# EAGLE design PCB 111000_CC (EAGLE 9.0.1)
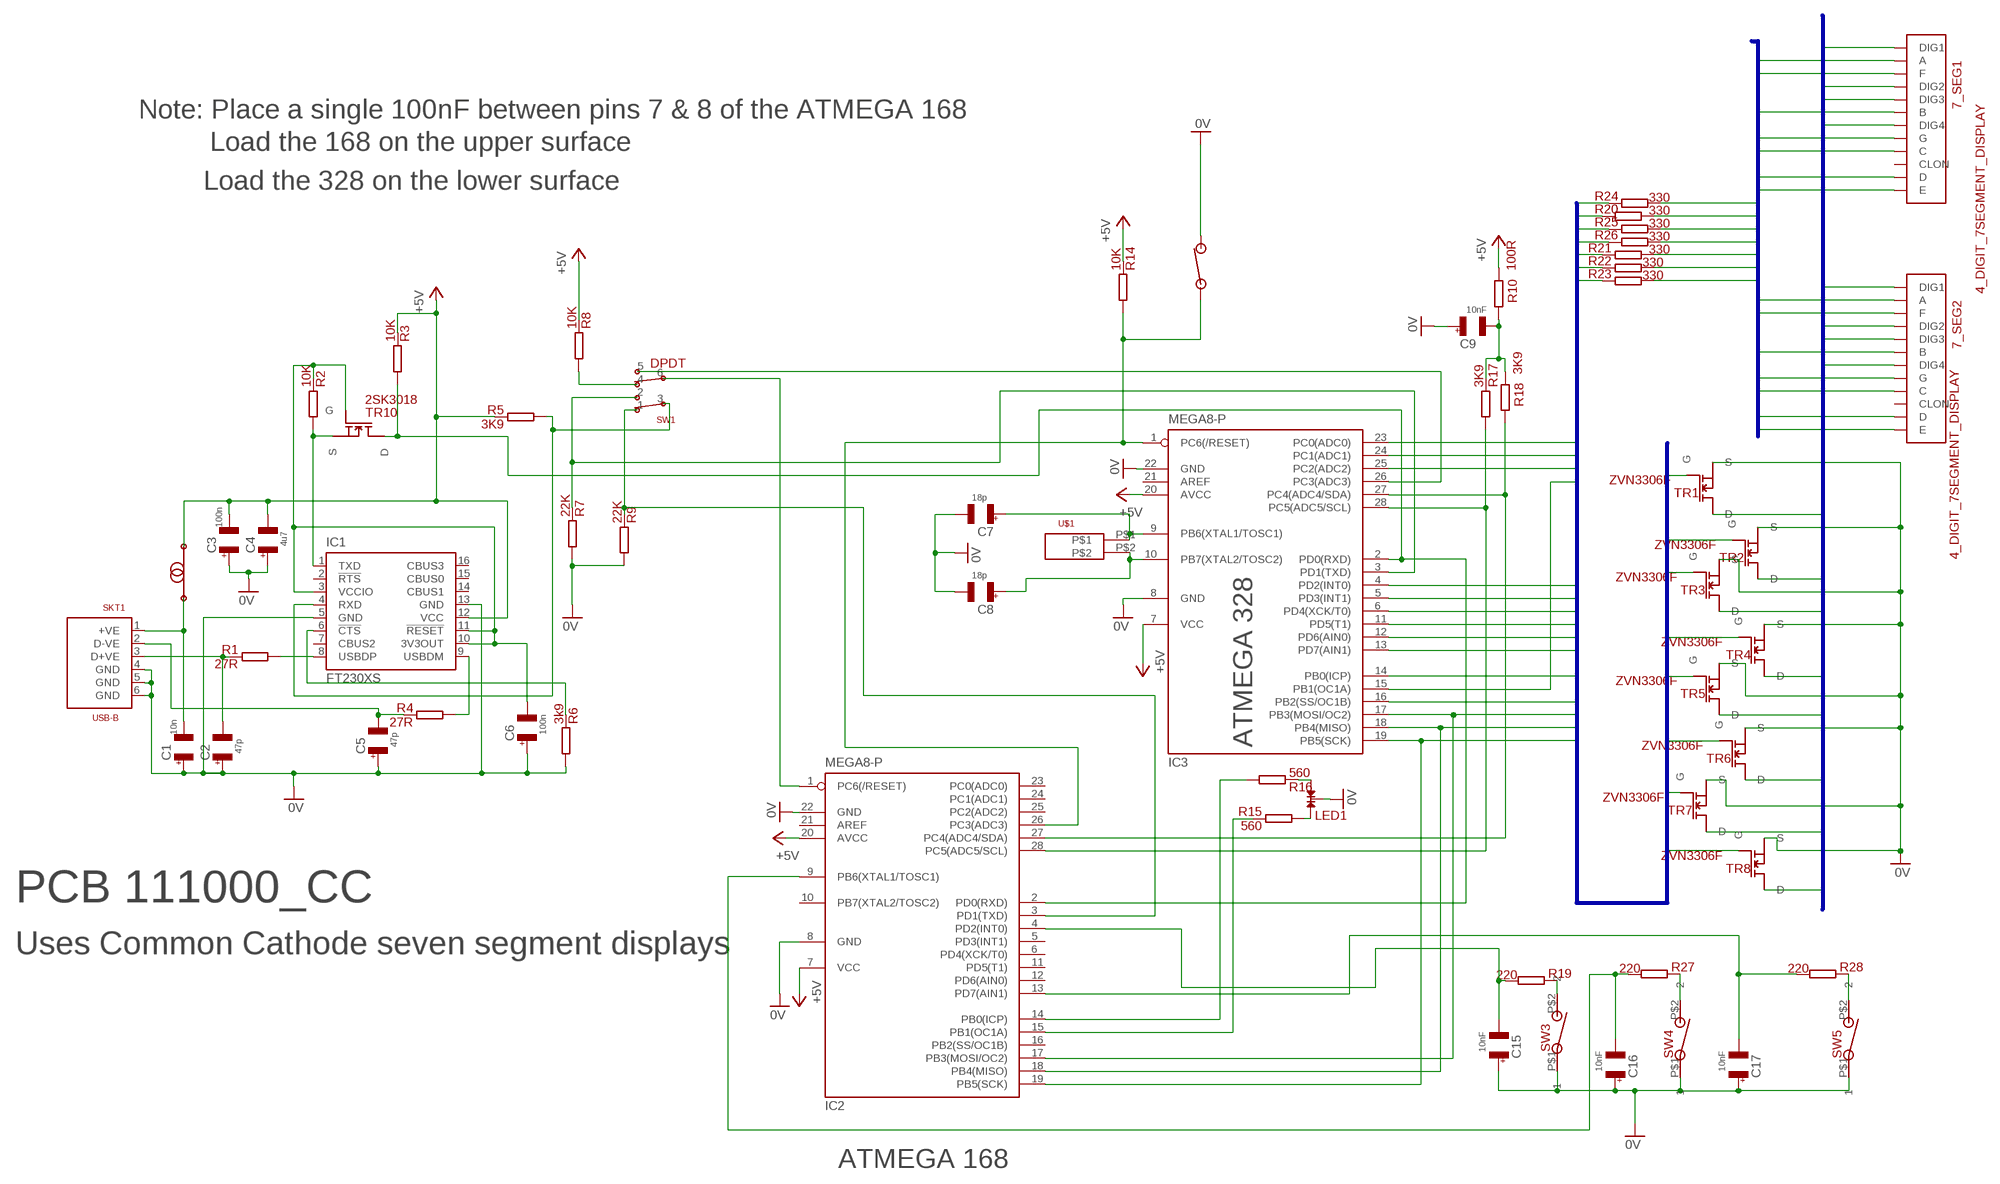
[diagram p0: schematic, sheet 1]

## Parts
7_SEG1  4_DIGIT_7SEGMENT_DISPLAY  [4_DIGIT_7SEGMENT_DISPLAY]
7_SEG2  4_DIGIT_7SEGMENT_DISPLAY  [4_DIGIT_7SEGMENT_DISPLAY]
C1  10n  1206C  [1206]
C2  47p  1206C  [1206]
C3  100n  1206C  [1206]
C4  4u7  1206C  [1206]
C5  47p  1206C  [1206]
C6  100n  1206C  [1206]
C7  18p  0805C  [0805]
C8  18p  0805C  [0805]
C9  10nF  1206C  [1206]
C15  10nF  1206C  [1206]
C16  10nF  1206C  [1206]
C17  10nF  1206C  [1206]
IC1  FT230XS  [SSOP16]
IC2  MEGA8-P  [DIL28-3]
IC3  MEGA8-P  [DIL28-3]
L1  CHOKE  [1206]
LED1  LED  [CA_DUAL_LED]
R1  27R  1206R  [1206]
R2  10K  1206R  [1206]
R3  10K  1206R  [1206]
R4  27R  1206R  [1206]
R5  3K9  1206R  [1206]
R6  3k9  1206R  [1206]
R7  22K  1206R  [1206]
R8  10K  1206R  [1206]
R9  22K  1206R  [1206]
R10  100R  1206R  [1206]
R14  10K  1206R  [1206]
R15  560  1206R  [1206]
R16  560  1206R  [1206]
R17  3K9  1206R  [1206]
R18  3K9  1206R  [1206]
R19  220  1206R  [1206]
R20  330  1206R  [1206]
R21  330  1206R  [1206]
R22  330  1206R  [1206]
R23  330  1206R  [1206]
R24  330  1206R  [1206]
R25  330  1206R  [1206]
R26  330  1206R  [1206]
R27  220  1206R  [1206]
R28  220  1206R  [1206]
SKT1  USB-B  [USB-B]
SW1  DPDT  [DPDT_SWITCH]
SW2  NO_SW  [SM_NO_PUSH_BUTTON]
SW3  NO_PB_1  [RE51-0711]
SW4  NO_PB_1  [RE51-0711]
SW5  NO_PB_1  [RE51-0711]
TR1  ZVN3306F  [SOT23]
TR2  ZVN3306F  [SOT23]
TR3  ZVN3306F  [SOT23]
TR4  ZVN3306F  [SOT23]
TR5  ZVN3306F  [SOT23]
TR6  ZVN3306F  [SOT23]
TR7  ZVN3306F  [SOT23]
TR8  ZVN3306F  [SOT23]
TR10  2SK3018  [2SK3018]
U$1  XTAL  [XTAL_VIAS]

## Nets
0V: C1.P$1 C2.P$1 C3.P$1 C4.P$1 C5.P$1 C6.P$1 C7.2 C8.2 C9.P$1 C15.P$1 C16.P$1 C17.P$1 IC1.5(GND) IC1.13(GND) IC2.8(GND) IC2.22(GND) IC3.8(GND) IC3.22(GND) LED1.2 R6.P$1 R7.P$1 R9.P$1 SKT1.4(GND) SKT1.5(GND) SKT1.6(GND) SW2.P$2 SW3.P$1 SW4.P$1 SW5.P$1 TR1.2(S) TR2.2(S) TR3.2(S) TR4.2(S) TR5.2(S) TR6.2(S) TR7.2(S) TR8.2(S)
+5V: C3.P$2 C4.P$2 IC1.12(VCC) IC2.7(VCC) IC2.20(AVCC) IC3.7(VCC) IC3.20(AVCC) L1.P$2 R3.P$2 R5.P$2 R8.P$2 R10.P$2 R14.P$2
DIGIT0: 7_SEG1.P$12(DIG1) TR5.3(D)
DIGIT1: 7_SEG1.P$9(DIG2) TR6.3(D)
DIGIT2: 7_SEG1.P$8(DIG3) TR7.3(D)
DIGIT3: 7_SEG1.P$6(DIG4) TR8.3(D)
DIGIT4: 7_SEG2.P$12(DIG1) TR1.3(D)
DIGIT5: 7_SEG2.P$9(DIG2) TR2.3(D)
DIGIT6: 7_SEG2.P$8(DIG3) TR3.3(D)
DIGIT7: 7_SEG2.P$6(DIG4) TR4.3(D)
DISPLAY_DRIVER0: IC3.15(PB1(OC1A)) R24.P$2
DISPLAY_DRIVER1: IC3.4(PD2(INT0)) R20.P$2
DISPLAY_DRIVER2: IC3.5(PD3(INT1)) R25.P$2
DISPLAY_DRIVER3: IC3.6(PD4(XCK/T0)) R26.P$2
DISPLAY_DRIVER4: IC3.11(PD5(T1)) R21.P$2
DISPLAY_DRIVER5: IC3.12(PD6(AIN0)) R22.P$2
DISPLAY_DRIVER6: IC3.13(PD7(AIN1)) R23.P$2
DISPLAY_DRIVER8: IC3.14(PB0(ICP)) TR1.1(G)
DISPLAY_DRIVER9: IC3.16(PB2(SS/OC1B)) TR2.1(G)
DISPLAY_DRIVER10: IC2.17(PB3(MOSI/OC2)) IC3.17(PB3(MOSI/OC2)) TR3.1(G)
DISPLAY_DRIVER11: IC2.18(PB4(MISO)) IC3.18(PB4(MISO)) TR4.1(G)
DISPLAY_DRIVER12: IC2.19(PB5(SCK)) IC3.19(PB5(SCK)) TR5.1(G)
DISPLAY_DRIVER13: IC3.23(PC0(ADC0)) TR6.1(G)
DISPLAY_DRIVER14: IC3.24(PC1(ADC1)) TR7.1(G)
DISPLAY_DRIVER15: IC3.25(PC2(ADC2)) TR8.1(G)
N$1: IC2.14(PB0(ICP)) R16.P$1
N$2: IC2.15(PB1(OC1A)) R15.P$2
N$3: LED1.1 R15.P$1
N$4: LED1.3 R16.P$2
N$5: IC3.26(PC3(ADC3)) SW1.5
N$6: IC3.3(PD1(TXD)) R7.P$2 SW1.2
N$7: R27.P$2 SW4.P$2
N$8: R19.P$2 SW3.P$2
N$9: C6.P$2 IC1.3(VCCIO) IC1.10(3V3OUT) IC1.11(!RESET) R2.P$2 TR10.2(G)
N$10: C7.1 IC3.9(PB6(XTAL1/TOSC1)) U$1.P$1
N$11: C17.P$2 IC2.13(PD7(AIN1)) R28.P$1
N$12: C8.1 IC3.10(PB7(XTAL2/TOSC2)) U$1.P$2
N$13: R8.P$1 SW1.4
N$14: IC2.3(PD1(TXD)) R9.P$2 SW1.1
N$15: IC1.1(TXD) R2.P$1 TR10.1(S)
N$16: R28.P$2 SW5.P$2
N$17: C15.P$2 IC2.4(PD2(INT0)) R19.P$1
N$18: IC1.9(USBDM) R4.P$1
N$19: C16.P$2 IC2.9(PB6(XTAL1/TOSC1)) R27.P$1
N$20: C9.P$2 R10.P$1 R17.P$2 R18.P$2
N$25: IC1.8(USBDP) R1.P$1
N$26: IC2.1(PC6(/RESET)) SW1.6
N$27: C5.P$2 R4.P$2 SKT1.2(D-VE)
N$29: C2.P$2 R1.P$2 SKT1.3(D+VE)
N$30: C1.P$2 L1.P$1 SKT1.1(+VE)
N$31: IC2.26(PC3(ADC3)) IC3.1(PC6(/RESET)) R14.P$1 SW2.P$1
N$34: IC1.6(!CTS) R6.P$2
N$35: IC1.4(RXD) R5.P$1 SW1.3
N$38: IC2.28(PC5(ADC5/SCL)) IC3.28(PC5(ADC5/SCL)) R17.P$1
N$39: IC2.27(PC4(ADC4/SDA)) IC3.27(PC4(ADC4/SDA)) R18.P$1
N$40: IC2.2(PD0(RXD)) IC3.2(PD0(RXD)) R3.P$1 TR10.3(D)
SEVEN_SEG0: 7_SEG1.P$11(A) 7_SEG2.P$11(A) R24.P$1
SEVEN_SEG1: 7_SEG1.P$7(B) 7_SEG2.P$7(B) R20.P$1
SEVEN_SEG2: 7_SEG1.P$4(C) 7_SEG2.P$4(C) R25.P$1
SEVEN_SEG3: 7_SEG1.P$2(D) 7_SEG2.P$2(D) R26.P$1
SEVEN_SEG4: 7_SEG1.P$1(E) 7_SEG2.P$1(E) R21.P$1
SEVEN_SEG5: 7_SEG1.P$10(F) 7_SEG2.P$10(F) R22.P$1
SEVEN_SEG6: 7_SEG1.P$5(G) 7_SEG2.P$5(G) R23.P$1
Unconnected: 7_SEG1.P$3(CLON) 7_SEG2.P$3(CLON) IC1.2(!RTS) IC1.7(CBUS2) IC1.14(CBUS1) IC1.15(CBUS0) IC1.16(CBUS3) IC2.5(PD3(INT1)) IC2.6(PD4(XCK/T0)) IC2.10(PB7(XTAL2/TOSC2)) IC2.11(PD5(T1)) IC2.12(PD6(AIN0)) IC2.16(PB2(SS/OC1B)) IC2.21(AREF) IC2.23(PC0(ADC0)) IC2.24(PC1(ADC1)) IC2.25(PC2(ADC2)) IC3.21(AREF)

## Buses
SEVEN_SEG[0..7]
DISPLAY_DRIVER[0..15]
DIGIT[0..7]

## Notes on the sheet
- Note: Place a single 100nF between pins 7 & 8 of the ATMEGA 168
- Load the 168 on the upper surface
- Load the 328 on the lower surface
- ATMEGA 328
- PCB 111000_CC
- Uses Common Cathode seven segment displays
- ATMEGA 168

## Library data of the parts
7_SEG1 7_SEG2 = 1_marko:4_DIGIT_7SEGMENT_DISPLAY: Common Anode RE 55-1674
C1-C6 C9 C15-C17 = 1_Home_library:1206C: 4.7uF RS 538-2335 100nF RS 264-4179
C7 C8 = 1_3V3_Bootloader:0805C: 1uF RS 451-5770 10nF 264-4371 100nF 264-4416
IC1 = 1_3V3_Bootloader:FT230X: USB to BASIC UART IC RS 757-0010
IC2 IC3 = 1_Home_library:MEGA8-P: MICROCONTROLLER 8 Kbytes FLASH, 1 kbytes SRAM, 512 bytes EEPROM, USART, 4-channel 10 bit ADC, 2-channel 8 bit ADC Pin compatible with Atmega48, ATMega88, ATMega168 Source: avr.lbr; OC_FARNELL: unknown; OC_NEWARK: unknown
L1 = 1_Home_library:CHOKE: RS 724-1582 1206 inductor
LED1 = 3_My_prog:LED: RS228-5770
R1-R10 R14-R28 = 1_Home_library:1206R
SKT1 = 3_My_prog:USB-B: RS 515-1967
SW1 = 1_Home_library:DPDT: DPST switch RE 76-0100
SW2 = 1_Home_library:NO_SW: SM NO push button RE 51-0709
SW3-SW5 = 1_3V3_Bootloader:NO_PB_1: RE 51-0711
TR1-TR8 = 1_3V3_Bootloader:ZVN3306F: RS275-945
TR10 = 1_3V3_Bootloader:2SK3018: SM equivalent of 2N7000 RS 694-2812
U$1 = 1_3V3_Bootloader:XTAL: Watch Crystal RS 478-9268

## Board
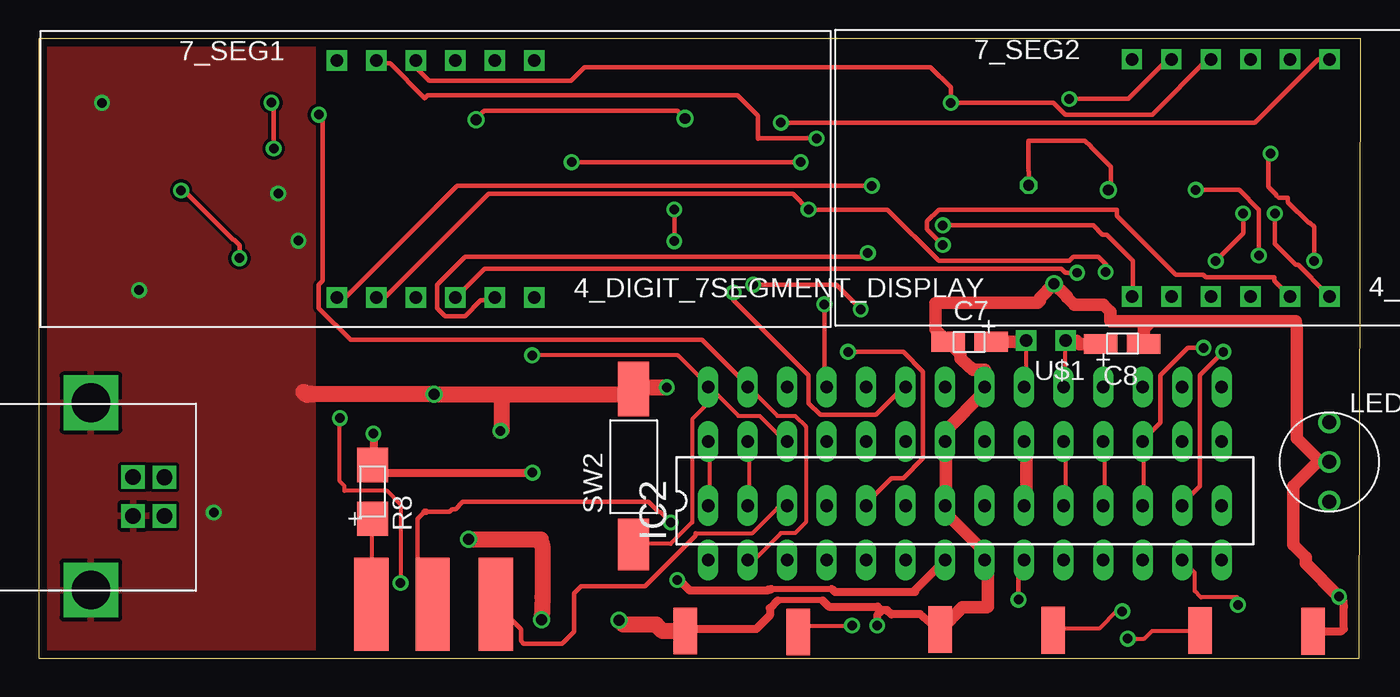
[diagram p1: board, top side]
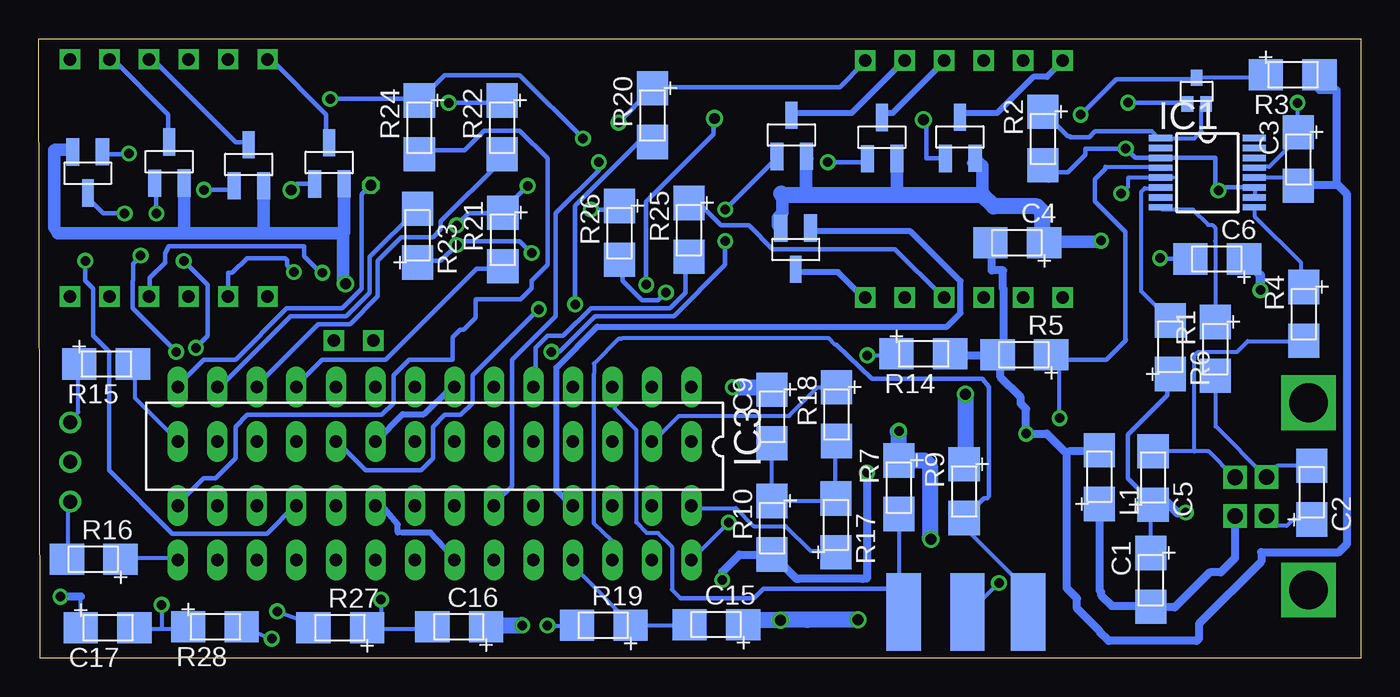
[diagram p2: board, bottom side, seen from below]

Size 85 x 39.8 mm. Coordinates in mm from the lower left corner, seen from the top.
Outline: 0,0 84.9,0 85,39.8 0,39.8 0,0
Copper layers (1*16): Top 0.035mm / dielectric 1.5mm / Bottom 0.035mm
Design rules "default *": minimum track width 10mil, minimum drill 24mil, track to track 8mil, track to pad 8mil, pad to pad 8mil, via to via 8mil, smd to smd 8mil, copper to edge 20mil, drill to drill 8mil, minimum pad ring 10mil, minimum via ring 8mil, stop-mask expansion 4mil, vias tented up to drill 0mil, thermal gap 10mil

### Footprints (pad centres in the part's own frame; a part is rotated, then mirrored left to right if it is on the bottom)
4_DIGIT_7SEGMENT_DISPLAY = drill 0.8 square: P$1 0,0; P$2 2.54,0; P$3 5.08,0; P$4 7.62,0; P$5 10.16,0; P$6 12.7,0; P$7 12.7,15.24; P$8 10.16,15.24; P$9 7.62,15.24; P$10 5.08,15.24; P$11 2.54,15.24; P$12 0,15.24
1206 = smd 2.2 x 2: P$1 -1.75,0; P$2 1.7,0
0805 = smd 2.159 x 1.27: 1 -1.404,0.1; 2 1.354,0.1
SSOP16 = smd 1.5 x 0.406: 1 -3.018,2.223; 2 -3.018,1.587; 3 -3.018,0.953; 4 -3.018,0.318; 5 -3.018,-0.318; 6 -3.018,-0.953; 7 -3.018,-1.587; 8 -3.018,-2.223; 9 3.018,-2.223; 10 3.018,-1.587; 11 3.018,-0.953; 12 3.018,-0.318; 13 3.018,0.318; 14 3.018,0.953; 15 3.018,1.587; 16 3.018,2.223
DIL28-3 = drill 0.813 long: 1 -16.51,-3.81; 2 -13.97,-3.81; 3 -11.43,-3.81; 4 -8.89,-3.81; 5 -6.35,-3.81; 6 -3.81,-3.81; 7 -1.27,-3.81; 8 1.27,-3.81; 9 3.81,-3.81; 10 6.35,-3.81; 11 8.89,-3.81; 12 11.43,-3.81; 13 13.97,-3.81; 14 16.51,-3.81; 15 16.51,3.81; 16 13.97,3.81; 17 11.43,3.81; 18 8.89,3.81; 19 6.35,3.81; 20 3.81,3.81; 21 1.27,3.81; 22 -1.27,3.81; 23 -3.81,3.81; 24 -6.35,3.81; 25 -8.89,3.81; 26 -11.43,3.81; 27 -13.97,3.81; 28 -16.51,3.81
CA_DUAL_LED = drill 0.9: 1 0,2.54; 2 0,0; 3 0,-2.54
USB-B = drill 1 square: 1 2.475,0.02; 2 -0.01,0.015; 3 -0.03,-2; 4 2.47,-2 | drill 2.5 square: 5 -4.8,-4.71; 6 7.24,-4.71
DPDT_SWITCH = smd 2.2 x 5: 1 -0.87,1.5; 2 7.13,1.5; 3 3.03,1.5 | smd 2.2 x 6 bottom: 4 -0.87,1; 5 7.13,1; 6 3.07,1
SM_NO_PUSH_BUTTON = smd 3.3 x 2: P$1 -2,1.5 | smd 3.5 x 2: P$2 8,1.5
RE51-0711 = smd 1.5 x 3: P$1 0.77,1.48; P$2 8.03,1.43
SOT23 = smd 0.85 x 1.75: 1 0.56,-2.08; 2 2.47,-2.07 | smd 0.75 x 1.75: 3 1.5,0.57
2SK3018 = smd 0.75 x 1: 1 0.6,-0.8; 2 -0.6,-0.8; 3 0,0.9
XTAL_VIAS = drill 0.8 square: P$1 0,1.27; P$2 0,-1.27

### Placement (x,y rotation side)
7_SEG1  19.16,23.17 0 top
7_SEG2  70.29,23.25 0 top
C1  13.5,5 270 bottom
C2  3.15,10.65 90 bottom
C3  4,32.05 270 bottom
C4  22.1,26.7 180 bottom
C5  13.35,11.6 90 bottom
C6  9.25,25.65 180 bottom
C7  59.83,20.44 180 top
C8  69.69,20.09 0 top
C9  37.85,15.5 270 bottom
C15  41.45,2.15 180 bottom
C16  58,2 180 bottom
C17  80.55,1.95 0 bottom
IC1  9.85,31.2 0 bottom
IC2  59.55,10.1 0 top
IC3  59.55,13.6 180 bottom
L1  16.8,11.65 90 bottom
LED1  82.99,12.6 0 top
R1  9.35,19.85 270 bottom
R2  20.43,33.37 270 bottom
R3  4.35,37.5 0 bottom
R4  3.65,22.1 270 bottom
R5  21.65,19.5 180 bottom
R6  12.25,20 90 bottom
R7  29.7,10.95 270 bottom
R8  21.45,10.7 90 top
R9  25.5,10.7 270 bottom
R10  37.85,8.35 270 bottom
R14  28.1,19.55 0 bottom
R15  80.65,18.9 0 bottom
R16  81.5,6.35 180 bottom
R17  33.75,8.55 90 bottom
R18  33.7,15.65 270 bottom
R19  48.7,2.1 180 bottom
R20  45.55,34.87 270 bottom
R21  55.17,26.88 270 bottom
R22  55.22,34.09 270 bottom
R23  60.65,27.17 90 bottom
R24  60.53,34.09 270 bottom
R25  43.2,27.5 270 bottom
R26  47.66,27.31 270 bottom
R27  65.65,1.95 180 bottom
R28  73.65,2 0 bottom
SKT1  8.06,11.61 270 top
SW1  22.25,4.45 180 bottom
SW2  39.75,9.3 90 top
SW3  40.8,0.25 0 top
SW4  57.2,0.35 0 top
SW5  82.7,3.2 180 top
TR1  67.83,32.56 0 bottom
TR2  73.01,32.43 0 bottom
TR3  78.12,32.6 0 bottom
TR4  80.35,30.47 180 bottom
TR5  27.27,34.19 0 bottom
TR6  32.28,34.18 0 bottom
TR7  38.1,34.33 0 bottom
TR8  34.82,25.56 180 bottom
TR10  10.55,36.4 0 bottom
U$1  64.75,20.4 90 top

### Tracks (layer width: path | path; a pad name or v marks a point on that pad's centre or on a via)
0V  (via drill 0.61, 0.7)
  Top 0.254: 41.78,1.85 SW3.P$1 | 57.78,1.85 SW4.P$1 | 81.78,1.85 SW5.P$1 | 82.93,12.6 LED1.2 | 54.94,2.82 54.92,2.82 | 56.66,2.82 54.81,2.82
  Top 0.305: 38.32,17.4 SW2.P$2 38.07,17.15
  Top 0.381: IC2.22 58.44,14 58.33,14
  Top 0.4: 50.4,3.7 47.5,3.7
  Top 0.5: 41.78,1.85 46.12,1.85 47,2.73 47,3.2 47.5,3.7 | 57.78,1.85 56.66,2.82 54.94,2.82 | 50.4,3.7 50.8,3.3 53.93,3.3 54.14,3.09 | 54.55,3.09 54.14,3.09 | 54.14,3.09 54.14,2.98 53.91,2.74 v53.91,2.09 | SW5.P$1 83.77,1.72 83.92,1.88 83.92,3.33 83.92,3.34 83.92,3.63 v83.61,3.94
  Top 0.56: 54.81,2.82 54.55,3.09
  Top 0.813: 58.33,9.84 58.33,14 58.33,14.62 60.82,17.11 IC3.8 60.82,18.52 60.83,18.52 60.06,18.52 59.9,18.68 59.87,18.68 59.28,19.27 59.28,19.53 C7.2 57.67,21.13 57.67,22.81 57.7,22.84 64.23,22.84 64.36,22.97 64.36,23.14 v65.28,24.06 66.11,23.24 66.11,23.2 66.59,22.72 68.44,22.72 68.89,22.27 68.89,21.69 68.92,21.66 71.58,21.66 | 58.33,9.84 IC3.22 | 58.33,9.84 58.33,9.3 60.8,6.84 60.8,6.31 | 60.8,6.31 IC2.8 61.03,6.09 61.03,3.3 60.98,3.26 59.4,3.26 SW4.P$1 | 82.93,12.6 82.21,12.6 80.66,11.04 80.66,7.28 81.47,6.47 81.47,6.08 v83.61,3.94 | 60.8,6.31 60.8,5.48 | LED1.2 82.42,12.6 80.89,14.12 80.89,21.15 80.81,21.66 71.58,21.66 | C8.2 71.05,21.12 71.58,21.66
  Top 1.016: 17.28,16.91 17.07,17.12 17,17.12 17.14,16.98 17.58,16.98 17.6,16.95 v25.41,16.95 29.77,16.95 | 29.77,16.95 37.55,16.95 C9.P$1 38.2,17.25 SW2.P$2 | 29.77,16.95 29.77,14.68 v29.69,14.61 | v27.62,7.64 32.27,7.62 32.38,7.18 32.38,3.93 v32.32,2.47 | SW3.P$1 40.12,1.73 C15.P$1 37.59,2.15 v37.3,2.44 | 38.32,17.4 v40.37,17.4 v40.38,17.4
  Bottom 0.254: 60.75,6.43 IC2.8 | 40.63,2.08 39.72,2.08 C15.P$1 | 56.18,1.85 C16.P$1 56.41,2.08 56.64,2.08 56.64,2.11 | 12.06,30.89 12.75,30.89 IC1.5 12.98,30.89 14.92,30.89 14.96,30.84 14.96,30.28 v15.39,29.86 | 7.72,26.54 7.72,25.86 C6.P$1 | 20.29,26.77 C4.P$1 | IC1.13 6.8,31.57 5.89,31.57 3.83,33.63 C3.P$1 4.06,33.86 v4.06,35.69 | 2.46,8.71 C2.P$1 4.35,8.9 4.75,8.5 5.45,8.5 5.89,8.94 SKT1.4 6.12,9.17 | 13.66,6.43 C1.P$1 13.5,9.24 13.66,9.4 13.43,9.63 C5.P$1 | 12.75,10.31 13.2,9.86 C5.P$1 | 13.43,9.86 C5.P$1 | 53.95,2.11 53.92,2.08 v53.92,2.09 | C17.P$1 82.3,3.93 82.28,3.95 | v83.61,3.95 v83.61,3.94
  Bottom 0.305: 38.07,17.4 C9.P$1 | 4.29,35.69 v4.06,35.69 | 25.37,12.57 R9.P$1 | v29.69,14.61 29.69,12.83 R7.P$1 | R6.P$1 12.42,18.16 12.42,16.89 14.96,14.35 14.96,11.56 13.43,10.03 C5.P$1
  Bottom 0.381: 37.12,27.72 TR8.2 | 35.66,32.11 TR7.2 35.37,32.11 | 20.47,27.14 C4.P$1 | TR6.2 | 24.85,32.11 25.14,31.81 TR5.2 24.85,32.11
  Bottom 0.5: v53.91,2.09 55.44,2.09 55.46,2.12 56.14,2.12 C16.P$1 | 82.28,3.95 v83.61,3.95
  Bottom 0.61: v11.25,9.35 11.78,9.35 12.75,10.31 | v6.45,23.65 6.45,24.6 C6.P$1
  Bottom 0.813: 20.29,26.77 16.75,26.77 v16.69,26.83 | TR6.2 29.81,29.86 29.91,29.76 | 35.66,32.11 35.66,29.76 | 37.17,29.76 37.17,28.61 37.47,28.31 37.47,27.81 TR8.2 | 24.32,29.76 24.32,31.65 TR5.2 | TR1.2 65.36,27.38 65.44,27.31 | 65.44,27.31 70.64,27.31 | 70.64,27.31 75.81,27.31 | 75.81,27.31 83.78,27.31 84,27.7 84,32.64 83.96,32.67 83.24,32.68 TR4.2 | TR2.2 70.54,27.41 70.64,27.31 | TR3.2 75.65,27.47 75.81,27.31 | 65.44,27.31 65.44,24.22 v65.28,24.06
  Bottom 1.016: 56.64,2.11 53.95,2.11 | v40.38,17.4 38.07,17.4 | v25.41,16.95 25.41,13.2 25.52,13.09 25.52,12.47 R9.P$1 | 29.69,12.83 29.69,14.49 29.77,14.56 | R7.P$1 28.05,12.7 27.71,12.35 27.71,7.73 v27.62,7.64 | v32.32,2.47 35.59,2.45 v37.29,2.45 v37.3,2.44 39.41,2.44 C15.P$1 | 20.47,27.14 20.47,28.7 20.8,29.03 23.59,29.03 24.32,29.76 29.91,29.76 35.66,29.76 37.17,29.76 37.27,29.86
  pour Top: 0.4,40.05 17.6,40.05 17.6,0.5 0.4,0.5
+5V  (via drill 0.61)
  Top 0.254: 21.66,12.37 R8.P$2 | 63.5,9.86 IC3.20 | 63.5,13.74 IC2.20 | 58.24,6.2 IC2.7
  Top 0.4: 47.1,4.45 51,4.45
  Top 0.5: v21.51,14.42 21.51,12.46 R8.P$2 21.48,11.87 31.7,11.87 v31.74,11.91 | v41.05,5.01 41.19,5.01 41.85,4.35 46.85,4.35 46.9,4.4 47.05,4.4 47.1,4.45 | 51,4.45 51.2,4.25 56.35,4.25 56.35,4.36 IC2.7
  Top 0.8: 63.5,13.74 63.5,9.86
  Bottom 0.254: IC1.12 6.8,30.89 4.52,30.89 4.06,30.43 C3.P$2 | 2.46,37.29 R3.P$2 2.65,36.5 | 3.83,30.43 C3.P$2 | 23.72,26.77 C4.P$2 23.72,26.54 23.72,26.17 | 26.95,18.97 26.46,19.46 R14.P$2 26.23,19.46 | 16.86,13.28 L1.P$2 | 23.49,19.46 R5.P$2 23.26,19.69 22.95,19.84 | 3.83,30.2 C3.P$2 | 58.47,17.4 IC3.7 | 63.27,13.97 IC2.20 | 37.89,6.43 R10.P$2 37.66,6.43 | 63.27,9.63 IC3.20 | 58.47,6.43 IC2.7 | 58.24,17.63 IC3.7 | 1.6,30.43 1.6,30.4 1.55,30.4 1.55,30.5 | 58.3,17.43 IC3.7
  Bottom 0.305: 36.16,5.08 36.28,5.08
  Bottom 0.4: 58.47,17.4 60.23,15.68 61.6,15.68 63.27,13.97 | 63.27,9.63 62.81,9.63 61.92,8.58 61.92,8.08 61.62,8.06 59.83,8.06 58.47,6.58 58.47,6.43
  Bottom 0.5: 26.23,19.46 23.49,19.46 | 22.95,19.84 22.95,23.73 23.01,23.73 23.01,24.92 23.72,24.92 23.72,26.17 | 3.83,30.43 1.6,30.43 | 2.65,36.5 1.55,36.5 1.55,30.5 0.86,29.81 0.86,7.34 1.4,6.8 6.4,6.8 6.4,6.2 10.4,2.2 10.4,1.25 10.55,1.1 16.2,1.1 16.8,1.7 16.8,1.75 18.23,3.18 18.23,3.83 18.9,4.5 18.9,13.13 | 16.86,13.28 18.75,13.28 18.9,13.13 | 18.9,13.13 20.19,14.42 v21.51,14.42 21.51,16.01 21.85,16.35 21.85,16.75 23.15,18.05 23.15,19.3 R5.P$2 | v31.74,11.91 31.76,5.1 32.02,5.08 36.16,5.08 | v41.05,5.01 41.05,5.55 39.95,6.65 R10.P$2 36.28,5.08 | 23.75,26.75 C4.P$2
DIGIT0
  Bottom 0.305: 19.27,38.23 7_SEG1.P$12
  Bottom 0.381: TR5.3 25.73,35.03 23.39,35.03 21.05,37.36 20.18,37.36 19.3,38.24 7_SEG1.P$12
DIGIT1
  Bottom 0.254: 26.92,38.2 7_SEG1.P$9
  Bottom 0.305: 26.92,38.2 26.92,38.36 26.85,38.43 | 26.89,38.23 7_SEG1.P$9
  Bottom 0.381: TR6.3 30.69,35.03 30.11,35.03 26.89,38.24 7_SEG1.P$9
DIGIT2
  Bottom 0.381: TR7.3 36.53,35.03 32.74,35.03 29.52,38.24 7_SEG1.P$8
DIGIT3
  Bottom 0.305: 31.97,23.24 7_SEG1.P$6
  Bottom 0.381: TR8.3 36.24,24.8 33.61,24.8 32.15,23.34 7_SEG1.P$6
DIGIT4
  Bottom 0.254: 70.35,38.43 7_SEG2.P$12
  Bottom 0.305: TR1.3 66.52,33.15 66.52,34.93 70.07,38.48 7_SEG2.P$12
DIGIT5
  Bottom 0.305: TR2.3 71.6,33.15 72.36,33.15 77.69,38.48 7_SEG2.P$9
DIGIT6
  Bottom 0.305: TR3.3 76.68,33.4 76.68,34.93 80.23,38.48 7_SEG2.P$8
DIGIT7  (via drill 0.61)
  Top 0.305: 7_SEG2.P$6 82.77,23.5 81,25.27 80.83,25.27 79.48,26.61 79.48,28.33 v79.49,28.58
  Bottom 0.305: 82.01,29.85 TR4.3 81.85,29.58 80.86,28.58 v79.49,28.58
DISPLAY_DRIVER0
  Bottom 0.305: R24.P$2 60.42,32.64 57.63,32.64 56.36,33.91 54.07,33.91 52.29,32.13 52.29,25.27 53.32,24.25 53.32,23.77 54.03,23.06 56.87,23.06 56.91,23.02 56.91,21.86 57.67,21.09 57.92,21.09 58.39,20.62 58.39,19.18 61.18,19.18 62.2,18.16 62.2,16.38 62.96,15.62 71.6,15.62 72.36,14.86 72.36,12.83 73.63,11.56 74.39,11.56 75.92,10.03 IC3.15
DISPLAY_DRIVER1  (via drill 0.61)
  Top 0.305: v50.52,22.73 50.52,17.65 IC3.4
  Bottom 0.305: v50.52,22.73 50.52,29.08 46.45,33.15 45.69,33.15 R20.P$2
DISPLAY_DRIVER2
  Bottom 0.305: R25.P$2 43.4,25.78 43.4,23.5 44.42,22.48 49.5,22.48 51.28,20.7 52.29,20.7 53.06,19.94 53.06,17.65 IC3.5
DISPLAY_DRIVER3  (via drill 0.61)
  Top 0.305: v44.67,23.5 44.67,22.99 49.5,18.16 49.5,16.38 50.26,15.62 53.82,15.62 55.6,17.4 IC3.6
  Bottom 0.305: v44.67,23.5 45.18,22.99 46.2,22.99 47.47,24.26 47.47,25.53 R26.P$2
DISPLAY_DRIVER4
  Bottom 0.305: R21.P$2 55.34,25.02 56.87,25.02 62.71,19.18 66.77,19.18 68.3,17.65 IC3.11
DISPLAY_DRIVER5
  Bottom 0.305: R22.P$2 55.34,32.39 55.34,31.88 59.15,28.07 59.15,27.56 59.66,27.05 61.69,27.05 63.22,25.53 63.22,23.24 64.99,21.46 67.03,21.46 70.84,17.65 IC3.12
DISPLAY_DRIVER6
  Bottom 0.305: R23.P$2 60.68,28.83 63.72,25.78 63.72,23.5 65.25,21.97 68.8,21.97 73.38,17.4 IC3.13
DISPLAY_DRIVER8  (via drill 0.7)
  Top 0.305: v63.65,30.39 63.65,31.3 63.64,31.32 63.64,32.11 63.63,32.14 63.63,33.25 63.71,33.26 67.28,33.26 67.64,32.89 67.64,32.86 68.92,31.58 68.92,30.24 v68.77,30.08
  Bottom 0.305: 67.03,30.61 TR1.1 68.38,30.47 v68.77,30.08 | IC3.14 75.92,17.65 74.39,19.18 72.36,19.18 69.06,22.48 65.5,22.48 64.23,23.75 64.23,29.56 | 64.23,29.56 | 64.23,29.56 64.23,29.81 v63.65,30.39
DISPLAY_DRIVER9  (via drill 0.61)
  Top 0.305: v74.39,30.1 77.19,30.1 78.46,28.83 v78.46,25.88 | v76.17,19.69 74.65,18.16 74.65,11.05 73.63,10.03 IC3.16
  Bottom 0.305: v74.39,30.1 72.61,30.1 TR2.1 | v76.17,19.69 78.96,22.48 78.96,24.26 78.92,24.3 78.92,25.34 78.46,25.81 v78.46,25.88
DISPLAY_DRIVER10  (via drill 0.61)
  Top 0.254: IC3.17 71.04,9.86 71.04,13.74 IC2.17
  Top 0.305: v77.44,28.58 77.44,27.31 75.68,25.55 v75.68,25.53 | v74.9,19.94 73.88,19.94 72.11,18.16 72.11,15.11 71.09,14.1 IC2.17
  Bottom 0.305: v77.44,28.58 77.44,30.35 TR3.1 | v75.68,25.53 74.14,24 74.14,20.7 v74.9,19.94
DISPLAY_DRIVER11  (via drill 0.61)
  Top 0.254: IC3.18 68.53,9.86 68.53,13.74 IC2.18
  Top 0.305: v82.01,25.53 82.01,27.72 81.75,27.99 81.65,27.99 80.33,29.31 80.33,29.58 79.72,29.58 79.59,29.72 79.59,29.78 79.06,30.3 79.06,32.29 v79.21,32.43
  Bottom 0.305: v82.01,25.53 82.01,24.26 81.5,23.75 81.5,20.7 80.49,19.69 80.49,12.07 76.42,8 70.33,8 68.55,9.78 IC3.18 | TR4.1 81,32.39 79.25,32.39 v79.21,32.43
DISPLAY_DRIVER12  (via drill 0.61, 0.7)
  Top 0.254: IC3.19 66.01,9.86 66.01,13.74 IC2.19
  Top 0.305: v45.94,24 51.28,24 v52.86,22.42 | v28.12,34.59 28.12,34.68 28.62,35.19 41.06,35.19 v41.56,34.69
  Bottom 0.305: v45.94,24 45.94,29.34 41.63,33.66 41.63,34.62 v41.56,34.69 | v52.86,22.42 57.12,18.16 57.12,16.38 57.88,15.62 58.9,15.62 59.66,14.86 59.66,12.83 60.42,12.07 63.98,12.07 65.76,13.84 IC2.19 | TR5.1 26.89,32.13 27.91,32.13 27.91,34.39 v28.12,34.59
DISPLAY_DRIVER13  (via drill 0.61)
  Top 0.305: v48.99,31.88 v34.26,31.88
  Bottom 0.305: v34.26,31.88 31.97,31.88 TR6.1 | v48.99,31.88 48.99,31.37 51.79,28.58 51.79,21.97 54.58,19.18 54.58,11.05 55.6,10.03 IC3.23
DISPLAY_DRIVER14  (via drill 0.61)
  Top 0.305: v40.86,26.8 v40.86,28.83 | v52.04,19.69 55.6,19.69 56.87,18.42 56.87,12.83 55.6,11.56 54.83,11.56 53.31,10.03 IC3.24
  Bottom 0.305: v40.86,28.83 37.56,32.13 TR7.1 | v40.86,26.8 40.86,25.27 44.17,21.97 49.25,21.97 51.53,19.69 v52.04,19.69
DISPLAY_DRIVER15
  Bottom 0.381: TR8.1 35.37,27.43 28.94,27.43 25.73,24.22 25.73,22.17 26.6,21.3 49.09,21.3 51.72,18.67 51.72,10.78 50.85,9.91 IC3.25
N$1
  Bottom 0.254: R16.P$1 79.73,6.43 76.07,6.43 IC2.14
N$2
  Bottom 0.254: R15.P$2 78.81,18.77 78.81,16.71 76.07,13.97 IC2.15
N$3
  Bottom 0.254: R15.P$1 82.47,18.77 82.47,15.8 82.93,15.34 LED1.1
N$4
  Bottom 0.254: R16.P$2 83.16,6.43 83.16,9.86 LED1.3
N$5
  Top 0.254: 42.24,8.03 45.89,8.03 47.49,9.63 47.95,9.63 IC3.26 | 29.43,3.45 SW1.5
  Top 0.305: SW1.5 30.99,1.84 30.99,1.09 31.17,0.91 33.63,0.91 34.41,1.7 34.41,4.17 34.85,4.62 38.98,4.62 42.24,7.87 42.24,8.03
N$6
  Bottom 0.254: 29.66,4.6 29.66,4.02 29.66,3.23 29.43,3 SW1.2 | 29.66,4.6 29.66,9.17 R7.P$2 | IC3.3 47.95,17.4 47.95,16.03 46.58,14.66 46.58,8.71 45.89,8.03 45.18,8.03 44.3,7.15 44.3,4.4 43.75,3.85 | 29.66,4.6 SW1.2 | 30.15,1.45 30.1,1.5 30.1,2.23 SW1.2
  Bottom 0.305: 43.75,3.85 39.96,3.85 39.95,3.84 39.02,3.84 38.4,4.47 30.11,4.47 29.66,4.02
N$7  (via drill 0.61)
  Top 0.254: 65.32,1.85 SW4.P$2 65.33,1.88 68.19,1.88 69.3,3 v69.67,3
  Bottom 0.254: v69.67,3 67.15,2.08 R27.P$2
N$8  (via drill 0.61)
  Top 0.254: v52.29,2.08 49.09,2.08 48.87,1.85 SW3.P$2
  Bottom 0.254: v52.29,2.08 50.47,2.08 R19.P$2
N$9  (via drill 0.61)
  Top 0.305: v15.1,32.75 15.1,35.55 v14.95,35.7 | v9.15,30.05 9.35,30.05 12.5,26.9 12.55,26.9 12.9,26.55 v12.9,25.7
  Bottom 0.254: IC1.10 6.8,29.74 6.8,30.2 IC1.11 | 11.15,35.69 TR10.2 11.15,35.46 | 20.06,30.66 20.2,31.03 R2.P$2
  Bottom 0.305: 11.15,35.69 14.94,35.69 v14.95,35.7 | C6.P$2 12.85,25.65 v12.9,25.7 | IC1.11 8.95,30.25 v9.15,30.05 9.35,30.25 9.35,32.15 IC1.3 14.5,32.15 v15.1,32.75 17.7,32.75 17.7,32.36 18.82,31.24 19.99,31.24 20.2,31.03
N$10
  Top 0.254: U$1.P$1 63.5,20.37 63.5,17.63 IC3.9
  Top 0.813: C7.1 63.42,20.34 U$1.P$1
N$11  (via drill 0.61)
  Top 0.254: v77.11,3.42 77.11,3.86 77.06,3.91 74.73,3.91 74.33,4.31 74.33,5.48 IC2.13
  Bottom 0.254: 77.08,1.85 75.61,1.85 R28.P$1 75.38,2.08 | 77.08,1.85 78.81,1.85 C17.P$2 | v77.11,3.42 77.11,1.89 77.08,1.85
N$12
  Top 0.254: U$1.P$2 66.01,20.37 66.01,17.63 IC3.10
  Top 0.813: U$1.P$2 66.71,20.4 66.92,20.19 C8.1
N$13
  Top 0.254: R8.P$1 21.43,8.94 21.43,3.45 SW1.4
N$14
  Bottom 0.254: SW1.1 21.43,3 21.43,4.37 25.32,8.26 25.32,8.94 R9.P$2 25.55,9.17 | IC2.3 48.18,6.43 48.18,7.57 49.32,8.65 49.32,18.25 49.3,18.27 49.3,18.92 47.72,20.51 47.54,20.51 47.5,20.55 34.2,20.55 33.79,20.14 33.78,20.14
  Bottom 0.305: 33.78,20.14 33.71,20.14 31.41,17.95 24.32,17.95 23.9,17.42 23.9,10.38 23.99,10.28 24.22,10.28 R9.P$2
N$15
  Bottom 0.254: TR10.1 10.23,35.46 10.23,33.86 10.69,33.4 12.75,33.4 IC1.1 12.98,33.4 13.43,33.86
  Bottom 0.305: 13.43,33.86 17.08,33.86 17.45,33.48 18.66,33.48 18.7,33.53 18.84,33.53 R2.P$1
N$16  (via drill 0.61)
  Top 0.254: 74.47,1.85 SW5.P$2 74.65,1.75 71.59,1.75 71.08,1.24 v70.02,1.24
  Bottom 0.254: 71.95,2.08 R28.P$2 71.82,1.87 v70.02,1.24
N$17
  Bottom 0.254: C15.P$2 43.15,2.08 46.81,2.08 R19.P$1 47.04,2.31 50.47,5.74 50.47,6.2 IC2.4
N$18
  Bottom 0.254: IC1.9 6.8,28.83 6.8,28.37 3.83,25.4 3.83,24.03 R4.P$1
N$19  (via drill 0.61)
  Top 0.254: 63.5,6.12 63.5,6.2 63.4,6.29 IC2.9
  Top 0.305: v63,3.75 63,5.92 IC2.9
  Bottom 0.254: 62.89,1.85 59.84,1.85 C16.P$2 | 63.5,1.85 63.72,1.85 R27.P$1 63.5,1.85 | 63.5,1.85 62.89,1.85 | 62.89,1.85 v63,3.75
N$20
  Bottom 0.254: C9.P$2 37.89,13.74 37.89,10.31 R10.P$1 37.66,10.09 33.78,10.09 R17.P$2 33.78,10.31 33.78,13.74 R18.P$2
N$25
  Bottom 0.254: IC1.8 12.75,28.83 10.78,28.83 9.8,27.85 9.55,27.85 9.35,27.65 9.35,26.81 9.32,26.77 9.32,21.74 R1.P$1
N$26  (via drill 0.61)
  Top 0.254: v40.63,8.71 40.67,8.68 39.99,9.36 | 25.55,4.37 25.55,3.45 SW1.6
  Top 0.305: 24.81,9.4 24.35,8.94 24.35,5.56 25.55,4.37 | 39.99,9.36 39.83,9.41 39.22,10.03 27.24,10.03 26.78,9.57 26.58,9.57 26.4,9.4 24.91,9.4
  Top 0.406: 24.81,9.4 24.91,9.4
  Bottom 0.254: v40.63,8.71 42.92,6.43 IC2.1
N$27
  Bottom 0.254: 10.69,13.28 9.77,13.28 8.17,11.69 SKT1.2 | 10.69,13.28 13.2,13.28 C5.P$2 | 10.69,13.28 10.69,19.46 10.46,19.69 7.95,19.69 7.26,20.37 3.83,20.37 R4.P$2
N$29
  Bottom 0.254: 5.66,11.91 5.89,11.69 SKT1.3 | 2.46,11.91 C2.P$2 5.35,12.35 SKT1.3 | R1.P$2 9.32,18.09 9.32,14.88 6.12,11.69 SKT1.3 | 5.75,11.95 SKT1.3
N$30
  Bottom 0.254: 13.89,3.68 13.89,3.23 | 13.89,3.23 13.89,2.77 C1.P$2 13.89,3.23 | 16.63,9.86 L1.P$1
  Bottom 0.5: L1.P$1 16.8,4.35 16.7,4.25 16.7,4.05 16,3.35 13.55,3.35 C1.P$2 13.45,3.25 11.95,3.25 9.7,5.5 9,5.5 8.08,6.42 SKT1.1
N$31  (via drill 0.61)
  Top 0.254: v31.72,19.46 41.09,19.46 42.92,17.63 IC3.1 | 43.61,16.94 43.15,17.4 IC3.1 | 43.61,16.94 44.98,15.57 46.35,15.57 47.95,13.97 IC2.26 | 43.61,16.94 42.01,15.34 42.01,8.71 40.63,7.34 38.35,7.34 SW2.P$1 | 43.61,16.94 IC3.1
  Bottom 0.254: v31.72,19.46 29.89,19.46 R14.P$1
N$34
  Bottom 0.254: IC1.6 12.98,30.2 13.89,30.2 14.12,29.97 14.12,23.57 12.29,21.74 R6.P$2
N$35  (via drill 0.61)
  Top 0.254: v23.26,4.83 23.26,9.86 22.35,10.77 19.67,10.77 19.65,10.75 19.65,11.05 19.35,11.35 v19.35,15.41 v19.36,15.42
  Bottom 0.254: 16.4,31.57 12.98,31.57 IC1.4 | 20.29,19.91 20.06,19.69 R5.P$1 | v23.26,4.83 25.09,3 SW1.3 | 20.06,19.46 R5.P$1 | v19.36,15.42 19.36,18.96 R5.P$1
  Bottom 0.305: 20.06,19.34 R5.P$1 19.58,19.18 16.34,19.18 15.09,20.44 15.09,20.5 15.11,20.53 15.11,27.41 17.09,29.38 17.09,30.78 16.4,31.46 16.4,31.57
N$38
  Top 0.254: IC2.28 43.15,13.74 43.15,9.86 IC3.28
  Bottom 0.254: R17.P$1 33.78,6.88 35.38,6.88 36.98,8.48 39.03,8.48 40.18,9.63 42.92,9.63 IC3.28
N$39
  Top 0.254: IC3.27 45.66,9.86 45.66,13.74 IC2.27
  Bottom 0.254: R18.P$1 34.92,17.4 36.75,15.57 43.84,15.57 45.44,13.97 IC2.27
N$40  (via drill 0.61)
  Top 0.254: IC2.2 45.66,6.43 46.12,6.43 47.72,8.03 48.64,8.03 49.32,8.71 49.32,14.88 48.64,15.57 47.49,15.57 45.66,17.4 IC3.2
  Top 0.305: v18,34.93 18.26,34.67 18.26,24.26 18,24 18,22.48 20.04,20.45 42.64,20.45 45.44,17.65 IC3.2
  Bottom 0.254: TR10.3 10.46,37.29 6.12,37.29 R3.P$1
  Bottom 0.305: v18,34.93 15.72,37.21 10.64,37.21 TR10.3
SEVEN_SEG0  (via drill 0.61)
  Top 0.305: v66.26,35.94 70.07,35.94 72.61,38.48 7_SEG2.P$11 | 7_SEG1.P$11 21.81,38.23 22.58,38.23 24.82,35.99 25,36.17 44.94,36.17 46.26,34.85 46.26,33.39 46.28,33.4 v50.01,33.4
  Bottom 0.305: v66.26,35.94 60.68,35.94 R24.P$1 60.42,35.94 58.9,37.47 54.07,37.47 v50.01,33.4
SEVEN_SEG1  (via drill 0.61)
  Top 0.305: v47.72,34.42 78.2,34.42 82.27,38.48 82.77,38.48 7_SEG2.P$7
  Bottom 0.305: 7_SEG1.P$7 31.97,38.23 33.5,36.7 45.44,36.7 R20.P$1 45.69,36.45 v47.72,34.42
SEVEN_SEG2  (via drill 0.61)
  Top 0.305: v66.77,24.77 66.01,24.77 65.76,25.02 28.67,25.02 26.89,23.24 7_SEG1.P$4
  Bottom 0.305: R25.P$1 43.15,29.08 42.39,29.08 41.12,27.81 39.34,27.81 37.82,26.29 29.94,26.29 26.89,23.24 7_SEG1.P$4 | v66.77,24.77 66.89,24.77 67.94,25.83 67.93,26.47 74.75,26.47 74.84,26.48 76.67,26.48 76.88,26 76.88,25.42 77.87,24.44 77.87,23.29 7_SEG2.P$4
SEVEN_SEG3  (via drill 0.61)
  Top 0.254: 21.66,23.12 7_SEG1.P$2
  Top 0.305: 7_SEG1.P$2 21.81,23.24 22.32,23.24 28.93,29.85 48.48,29.85 v49.5,28.83 54.58,28.83 57.88,25.53 66.26,25.53 66.52,25.78 67.03,25.78 67.04,25.8 68.12,25.8 68.6,25.32 v68.6,24.81
  Bottom 0.305: v49.5,28.83 47.72,28.83 R26.P$1 | 7_SEG2.P$2 72.83,24.76 72.83,24.77 72.56,24.77 71.62,25.7 69.16,25.7 69.03,25.58 69.03,25.25 v68.6,24.81
SEVEN_SEG4  (via drill 0.61)
  Top 0.305: v58.14,27.81 67.81,27.81 68.39,27.22 68.69,27.22 70.36,25.55 70.36,23.32 7_SEG2.P$1 | v53.56,30.35 26.89,30.35 19.78,23.24 19.27,23.24 7_SEG1.P$1
  Bottom 0.305: v58.14,27.81 57.37,28.58 55.34,28.58 R21.P$1 55.09,28.83 v53.56,30.35
SEVEN_SEG5  (via drill 0.61)
  Top 0.305: 7_SEG2.P$10 75.15,38.48 71.6,34.93 66.01,34.93 65.25,35.69 v58.64,35.69 58.64,36.7 57.35,37.99 35.1,37.99 34.22,37.11 25.11,37.11 24.35,37.86 24.35,38.23 7_SEG1.P$10
  Bottom 0.305: v58.64,35.69 55.34,35.69 R22.P$1
SEVEN_SEG6  (via drill 0.61)
  Top 0.305: v58.14,26.54 57.12,27.56 57.12,28.07 57.88,28.83 69.31,28.83 69.31,28.43 73.1,24.64 74.88,24.64 75.05,24.47 79.45,24.47 79.45,24.24 7_SEG2.P$5 | v53.31,26.04 53.06,25.78 27.4,25.78 25.62,24 25.62,22.48 26.13,21.97 27.4,21.97 28.42,22.99 29.18,22.99 7_SEG1.P$5
  Bottom 0.305: R23.P$1 60.42,25.53 59.15,25.53 v58.14,26.54 57.88,26.8 54.07,26.8 v53.31,26.04